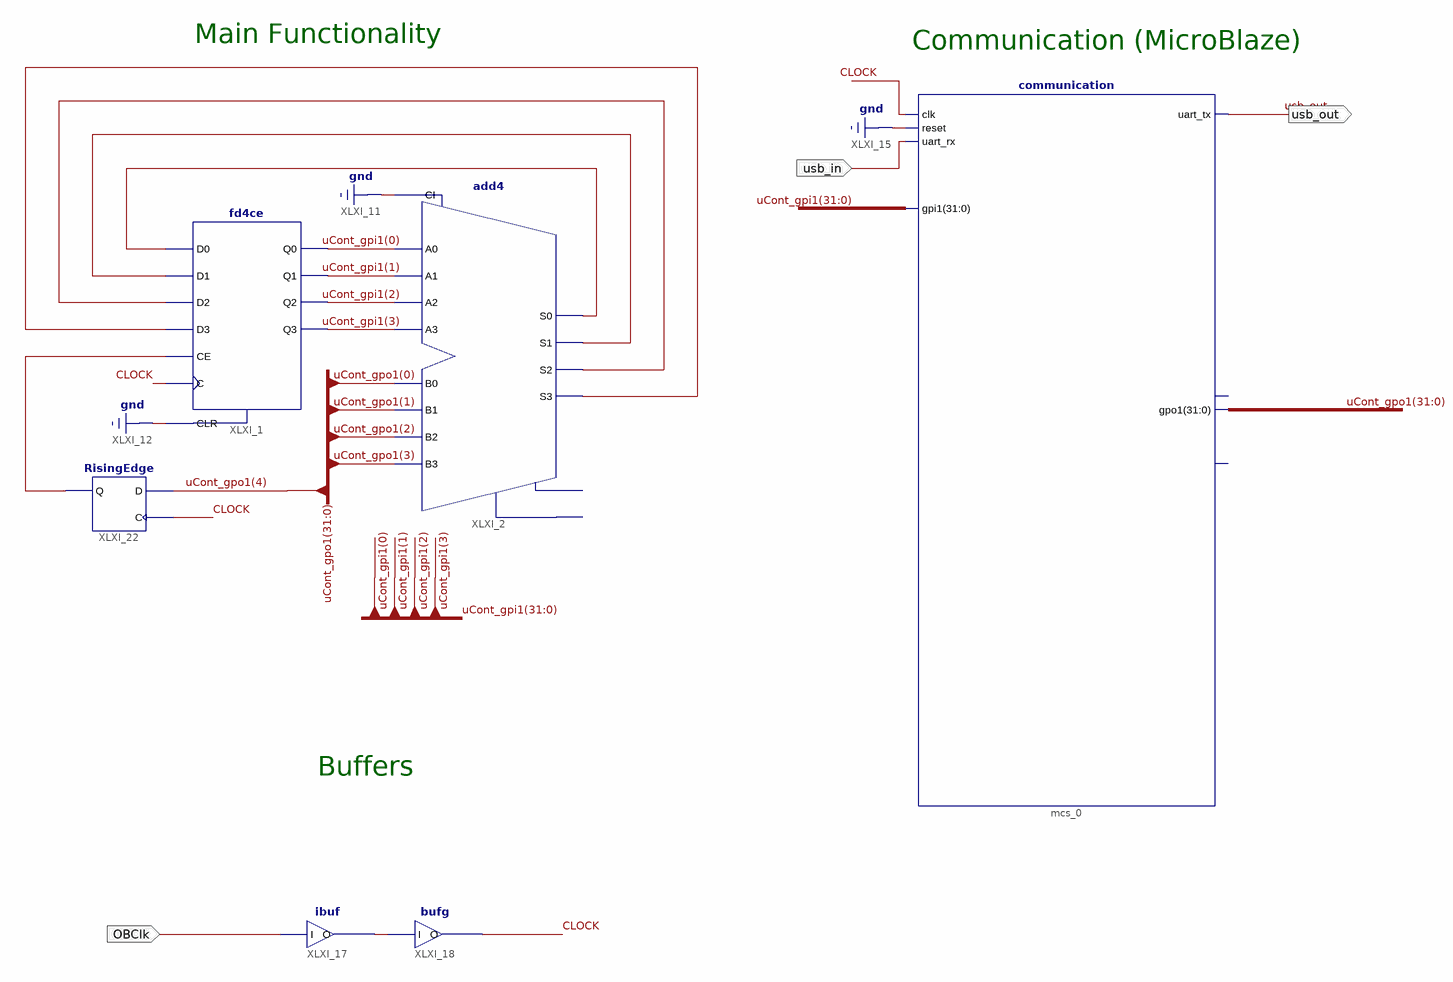
[diagram p0: schematic sheet 1]
// Xilinx ISE schematic simple.sch (artix7) as structural Verilog: 6 symbols, 3 ports
module simple (
  input  usb_in,
  input  OBClk,
  output usb_out
);

  wire CLOCK, XLXN_14, XLXN_15, XLXN_45, XLXN_46, XLXN_56, XLXN_61;
  wire [31:0] uCont_gpi1, uCont_gpo1;

  fd4ce XLXI_1 (
    .C(CLOCK), .CE(XLXN_61), .CLR(1'b0), .D0(XLXN_14), .D1(XLXN_15), .D2(XLXN_45), .D3(XLXN_46),
    .Q0(uCont_gpi1[0]), .Q1(uCont_gpi1[1]), .Q2(uCont_gpi1[2]), .Q3(uCont_gpi1[3]));
  add4 XLXI_2 (
    .A0(uCont_gpi1[0]), .A1(uCont_gpi1[1]), .A2(uCont_gpi1[2]), .A3(uCont_gpi1[3]), .B0(uCont_gpo1[0]),
    .B1(uCont_gpo1[1]), .B2(uCont_gpo1[2]), .B3(uCont_gpo1[3]), .CI(1'b0), .S0(XLXN_14), .S1(XLXN_15),
    .S2(XLXN_45), .S3(XLXN_46));  // open: CO, OFL
  ibuf XLXI_17 (.I(OBClk), .O(XLXN_56));
  bufg XLXI_18 (.I(XLXN_56), .O(CLOCK));
  RisingEdge XLXI_22 (.D(uCont_gpo1[4]), .C(CLOCK), .Q(XLXN_61));
  communication mcs_0 (
    .clk(CLOCK), .reset(1'b0), .uart_tx(usb_out), .uart_rx(usb_in), .gpi1(uCont_gpi1), .gpo1(uCont_gpo1));  // open: uart_interrupt, intc_irq

  // Notes on the sheet:
  //   Main Functionality
  //   Communication (MicroBlaze)
  //   Buffers
endmodule
